# EasyEDA schematic 0000.json
TITLE: Sheet_1; REV: 1.0; Date: 2020-10-04; Sheet: 1/1; Company: Your Company
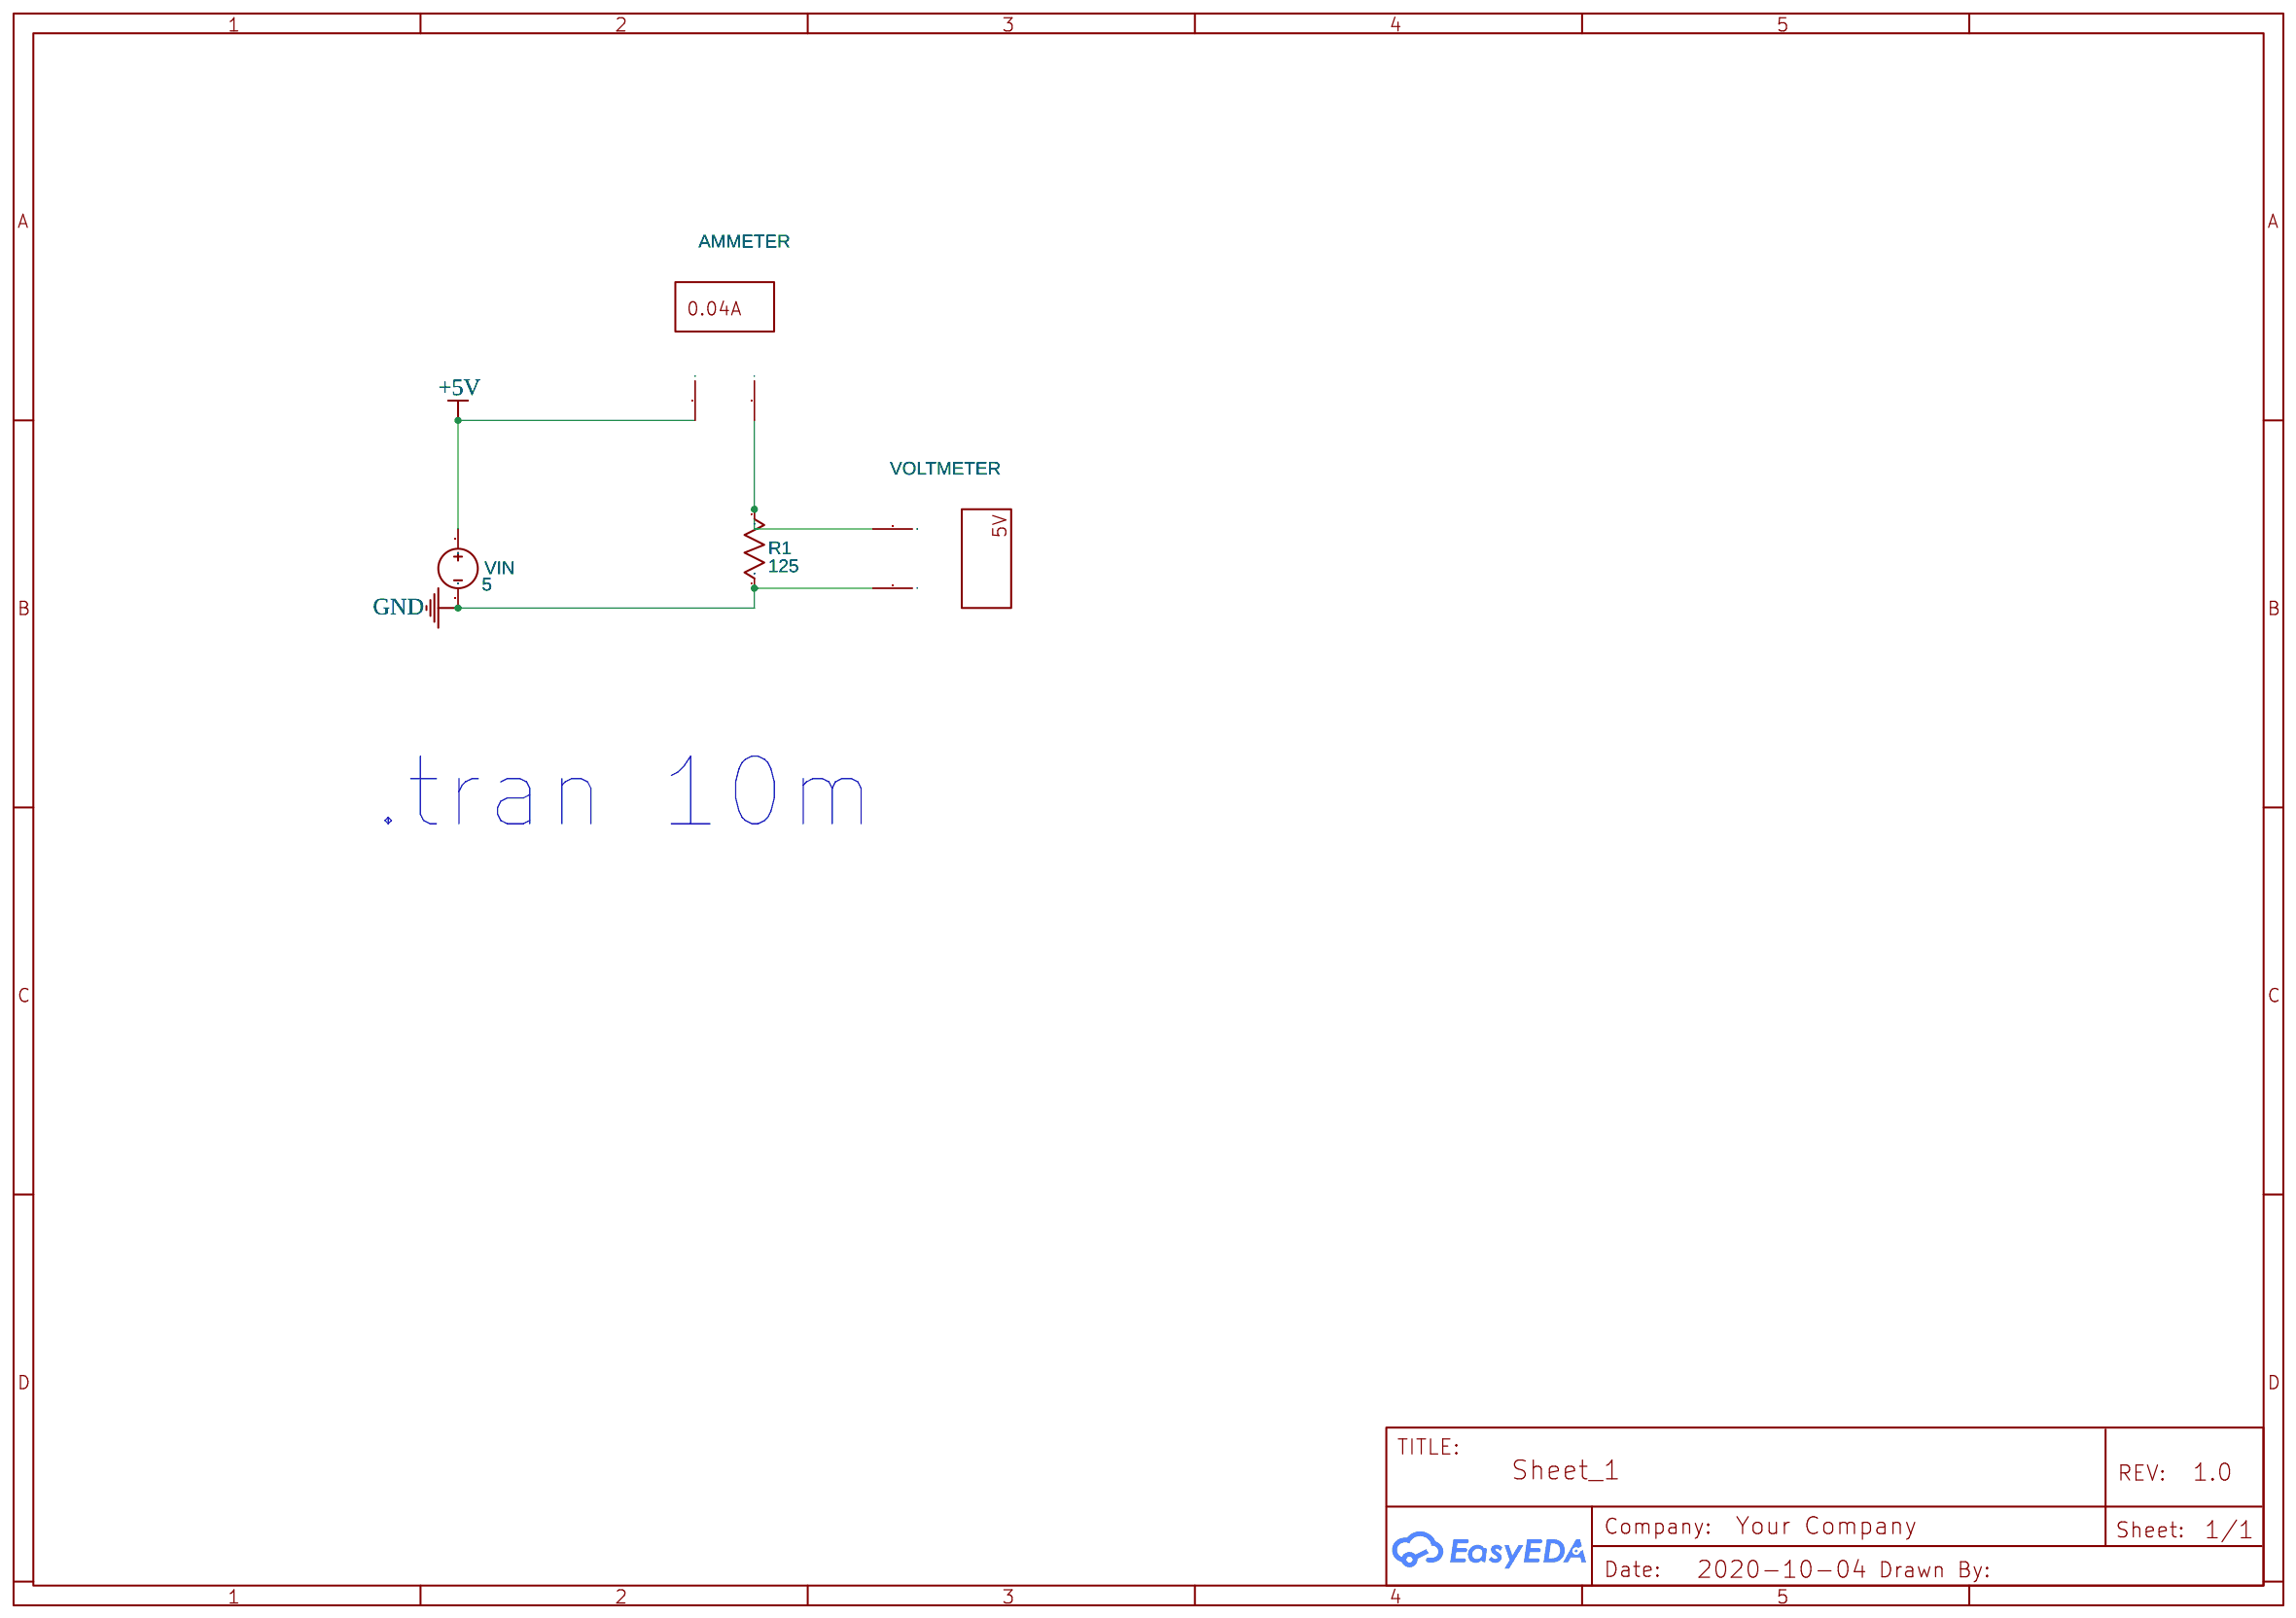
[diagram p0: schematic sheet]

## Parts
AMMETER  Multimeter
R1  125  [AXIAL-0.3]
VIN  5  [HDR1X2]
VOLTMETER  Multimeter

## Library data of the parts
AMMETER = MULTIMETER: Supplier: LCSC; Multimeter Type: Amper; Power Type: AC; Voltmeter resistance: 10μ; Ammeter resistance: 1G; NameDisplay: 0; Contributor: EasyEDA; sim: true
R1 = Resistor_US: Resistance: 1k; Contributor: EasyEDA; Supplier: YUJING
VIN = VDC: Contributor: EasyEDA; sim: true
VOLTMETER = MULTIMETER: Supplier: LCSC; Multimeter Type: Volt; Power Type: AC; Voltmeter resistance: 10μ; Ammeter resistance: 1G; NameDisplay: 0; Contributor: EasyEDA; sim: true

## Nets
+5V: AMMETER.1(+) VIN.1
GND: R1.1 VIN.2 VOLTMETER.2(I)
Net-(AMMETER-2): AMMETER.2(I) R1.2 VOLTMETER.1(+)

## Notes on the sheet
- .tran 10m
